# EAGLE design line_follower (EAGLE 9.5.0)

## Sheet 1 of 2
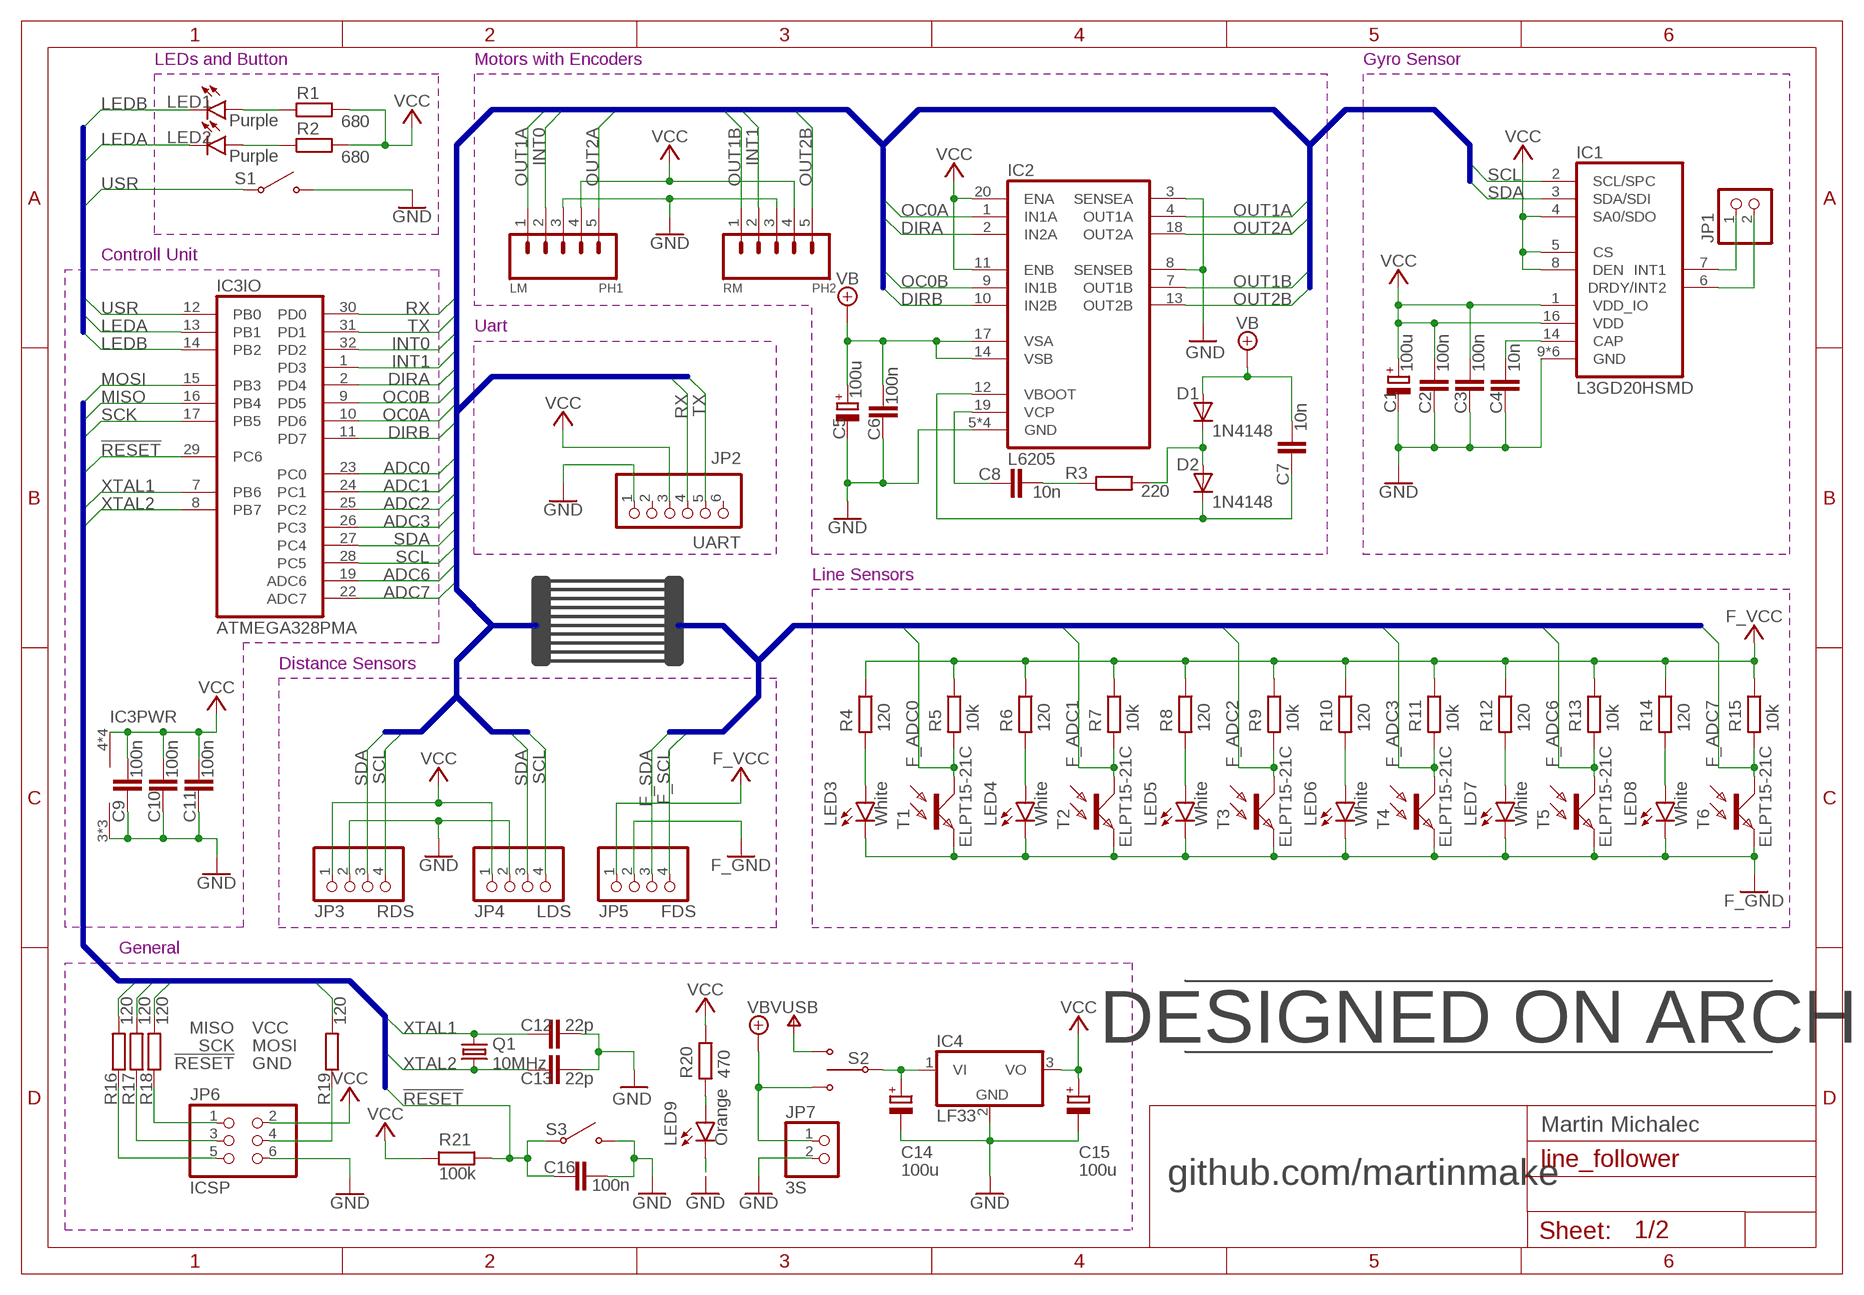
[diagram p0: schematic, sheet 1]

### Parts
C1  100u  CPOL-EUUD-6,3X8,8  [UD-6,3X5,8_NICHICON]
C2  100n  C-EUC1206  [C1206]
C3  100n  C-EUC1206  [C1206]
C4  10n  C-EUC1206  [C1206]
C5  100u  CPOL-EUUD-6,3X8,8  [UD-6,3X5,8_NICHICON]
C6  100n  C-EUC1206  [C1206]
C7  10n  C-EUC1206  [C1206]
C8  10n  C-EUC1206  [C1206]
C9  100n  C-EUC1206  [C1206]
C10  100n  C-EUC1206  [C1206]
C11  100n  C-EUC1206  [C1206]
C12  22p  C-EUC1206  [C1206]
C13  22p  C-EUC1206  [C1206]
C14  100u  CPOL-EUUD-6,3X8,8  [UD-6,3X5,8_NICHICON]
C15  100u  CPOL-EUUD-6,3X8,8  [UD-6,3X5,8_NICHICON]
C16  100n  C-EUC1206  [C1206]
D1  1N4148  DIODE  [1206]
D2  1N4148  DIODE  [1206]
IC1  L3GD20HSMD  [LGA-16]
IC2  L6205  [SO20]
IC3  ATMEGA328PMA  [TQFP32]
IC4  LF33  LM340H-05  [TO220H]
JP1  PINHD-1X2  [1X02]
JP2  UART  PINHD-1X6  [1X06]
JP3  RDS  PINHD-1X4/90  [1X04/90]
JP4  LDS  PINHD-1X4/90  [1X04/90]
JP5  FDS  PINHD-1X4/90  [1X04/90]
JP6  ICSP  PINHD-2X3  [2X03]
JP7  3S  PINHD-1X2  [1X02]
LED1  Purple  LEDSML1206  [SML1206]
LED2  Purple  LEDSML1206  [SML1206]
LED3  White  LEDSML1206  [SML1206]
LED4  White  LEDSML1206  [SML1206]
LED5  White  LEDSML1206  [SML1206]
LED6  White  LEDSML1206  [SML1206]
LED7  White  LEDSML1206  [SML1206]
LED8  White  LEDSML1206  [SML1206]
LED9  Orange  LEDSML1206  [SML1206]
PH1  LM  CONN_05JST-VERT  [JST-5-PTH-VERT]
PH2  RM  CONN_05JST-VERT  [JST-5-PTH-VERT]
Q1  10MHz  CSM-7X-DU  [CSM-7X-DU]
R1  680  R-EU_R1206  [R1206]
R2  680  R-EU_R1206  [R1206]
R3  220  R-EU_R1206  [R1206]
R4  120  R-EU_R1206  [R1206]
R5  10k  R-EU_R1206  [R1206]
R6  120  R-EU_R1206  [R1206]
R7  10k  R-EU_R1206  [R1206]
R8  120  R-EU_R1206  [R1206]
R9  10k  R-EU_R1206  [R1206]
R10  120  R-EU_R1206  [R1206]
R11  10k  R-EU_R1206  [R1206]
R12  120  R-EU_R1206  [R1206]
R13  10k  R-EU_R1206  [R1206]
R14  120  R-EU_R1206  [R1206]
R15  10k  R-EU_R1206  [R1206]
R16  120  R-EU_R1206  [R1206]
R17  120  R-EU_R1206  [R1206]
R18  120  R-EU_R1206  [R1206]
R19  120  R-EU_R1206  [R1206]
R20  470  R-EU_R1206  [R1206]
R21  100k  R-EU_R1206  [R1206]
S1  BUTTON  [BUTTON]
S2  DUALSWITCH  [DUALSWITCH]
S3  BUTTON  [BUTTON]
T1  ELPT15-21C  [1206]
T2  ELPT15-21C  [1206]
T3  ELPT15-21C  [1206]
T4  ELPT15-21C  [1206]
T5  ELPT15-21C  [1206]
T6  ELPT15-21C  [1206]

### Nets
!RESET: C16.1 IC3.29(IO:PC6) R16.2 R21.2 S3.A@1 S3.A@2
ADC0: IC3.23(IO:PC0) ; also sheet 2
ADC1: IC3.24(IO:PC1) ; also sheet 2
ADC2: IC3.25(IO:PC2) ; also sheet 2
ADC3: IC3.26(IO:PC3) ; also sheet 2
ADC6: IC3.19(IO:ADC6) ; also sheet 2
ADC7: IC3.22(IO:ADC7) ; also sheet 2
DIRA: IC2.2(IN2A) IC3.2(IO:PD4)
DIRB: IC2.10(IN2B) IC3.11(IO:PD7)
F_ADC0: R5.2 T1.1(C) ; also sheet 2
F_ADC1: R7.2 T2.1(C) ; also sheet 2
F_ADC2: R9.2 T3.1(C) ; also sheet 2
F_ADC3: R11.2 T4.1(C) ; also sheet 2
F_ADC6: R13.2 T5.1(C) ; also sheet 2
F_ADC7: R15.2 T6.1(C) ; also sheet 2
F_GND: JP5.2 LED3.C LED4.C LED5.C LED6.C LED7.C LED8.C T1.2(E) T2.2(E) T3.2(E) T4.2(E) T5.2(E) T6.2(E) ; also sheet 2
F_SCL: JP5.4 ; also sheet 2
F_SDA: JP5.3 ; also sheet 2
F_VCC: JP5.1 R4.1 R5.1 R6.1 R7.1 R8.1 R9.1 R10.1 R11.1 R12.1 R13.1 R14.1 R15.1 ; also sheet 2
GND: C1.- C2.2 C3.2 C4.2 C5.- C6.2 C9.2 C10.2 C11.2 C12.1 C13.1 C14.- C15.- C16.2 IC1.9(GND) IC1.10(GND) IC1.11(GND) IC1.12(GND) IC1.13(GND) IC1.15(GND) IC2.3(SENSEA) IC2.5(GND) IC2.6(GND) IC2.8(SENSEB) IC2.15(GND) IC2.16(GND) IC3.3(PWR:GND) IC3.5(PWR:GND) IC3.21(PWR:GND) IC4.2(GND) JP2.1 JP3.2 JP4.2 JP6.6 JP7.2 LED9.C PH1.3 PH2.3 S1.B@1 S1.B@2 S3.B@1 S3.B@2 ; also sheet 2
INT0: IC3.32(IO:PD2) PH1.2
INT1: IC3.1(IO:PD3) PH2.2
LEDA: IC3.13(IO:PB1) LED2.C
LEDB: IC3.14(IO:PB2) LED1.C
MISO: IC3.16(IO:PB4) R18.2
MOSI: IC3.15(IO:PB3) R19.2
N$1: LED5.A R8.2
N$2: C7.1 D2.2(C) IC2.12(VBOOT)
N$3: D1.2(C) D2.1(A) R3.2
N$4: C8.2 R3.1
N$5: LED1.A R1.1
N$6: C4.1 IC1.14(CAP)
N$7: C8.1 IC2.19(VCP)
N$8: IC1.7(INT1) JP1.1
N$9: IC1.6(DRDY/INT2) JP1.2
N$10: C14.+ IC4.1(VI) S2.COM
N$12: LED6.A R10.2
N$13: LED2.A R2.1
N$22: LED8.A R14.2
N$30: LED7.A R12.2
N$33: JP6.1 R18.1
N$36: LED9.A R20.2
N$43: LED4.A R6.2
N$47: LED3.A R4.2
N$49: JP6.3 R17.1
N$50: JP6.5 R16.1
N$51: JP6.4 R19.1
OC0A: IC2.1(IN1A) IC3.10(IO:PD6)
OC0B: IC2.9(IN1B) IC3.9(IO:PD5)
OUT1A: IC2.4(OUT1A) PH1.1
OUT1B: IC2.7(OUT1B) PH2.1
OUT2A: IC2.18(OUT2A) PH1.5
OUT2B: IC2.13(OUT2B) PH2.5
RX: IC3.30(IO:PD0) JP2.4
SCK: IC3.17(IO:PB5) R17.2
SCL: IC1.2(SCL/SPC) IC3.28(IO:PC5) JP3.4 JP4.4 ; also sheet 2
SDA: IC1.3(SDA/SDI) IC3.27(IO:PC4) JP3.3 JP4.3 ; also sheet 2
TX: IC3.31(IO:PD1) JP2.5
USR: IC3.12(IO:PB0) S1.A@1 S1.A@2
VB: C5.+ C6.1 C7.2 D1.1(A) IC2.14(VSB) IC2.17(VSA) JP7.1 S2.A
VCC: C1.+ C2.1 C3.1 C9.1 C10.1 C11.1 C15.+ IC1.1(VDD_IO) IC1.4(SA0/SDO) IC1.5(CS) IC1.8(DEN) IC1.16(VDD) IC2.11(ENB) IC2.20(ENA) IC3.4(PWR:VCC) IC3.6(PWR:VCC) IC3.18(PWR:VCC) IC3.20(PWR:VCC) IC4.3(VO) JP2.3 JP3.1 JP4.1 JP6.2 PH1.4 PH2.4 R1.2 R2.2 R20.1 R21.1 ; also sheet 2
VUSB: S2.B ; also sheet 2
XTAL1: C12.2 IC3.7(IO:PB6) Q1.2
XTAL2: C13.2 IC3.8(IO:PB7) Q1.1
Unconnected: JP2.2 JP2.6

### Buses
MISO,MOSI,MOSIR,!RESET,SCK,XTAL1,XTAL2
LEDA,LEDB,USR
FRONT:F_ADC0,F_ADC1,F_ADC2,F_ADC3,F_ADC6,F_ADC7,F_SCL,F_SDA
ADC0,ADC1,ADC2,ADC3,ADC6,ADC7,DIRA,DIRB,INT0,INT1,OC0A,OC0B,OUT1A,OUT1B,OUT2A,OUT2B,RX,SCL,SDA,TX

### Notes on the sheet
- LEDs and Button | Motors with Encoders | Gyro Sensor
- Controll Unit
- Uart
- Line Sensors
- Distance Sensors
- General
- DESIGNED ON ARCH
- Martin Michalec
- github.com/martinmake

## Sheet 2 of 2
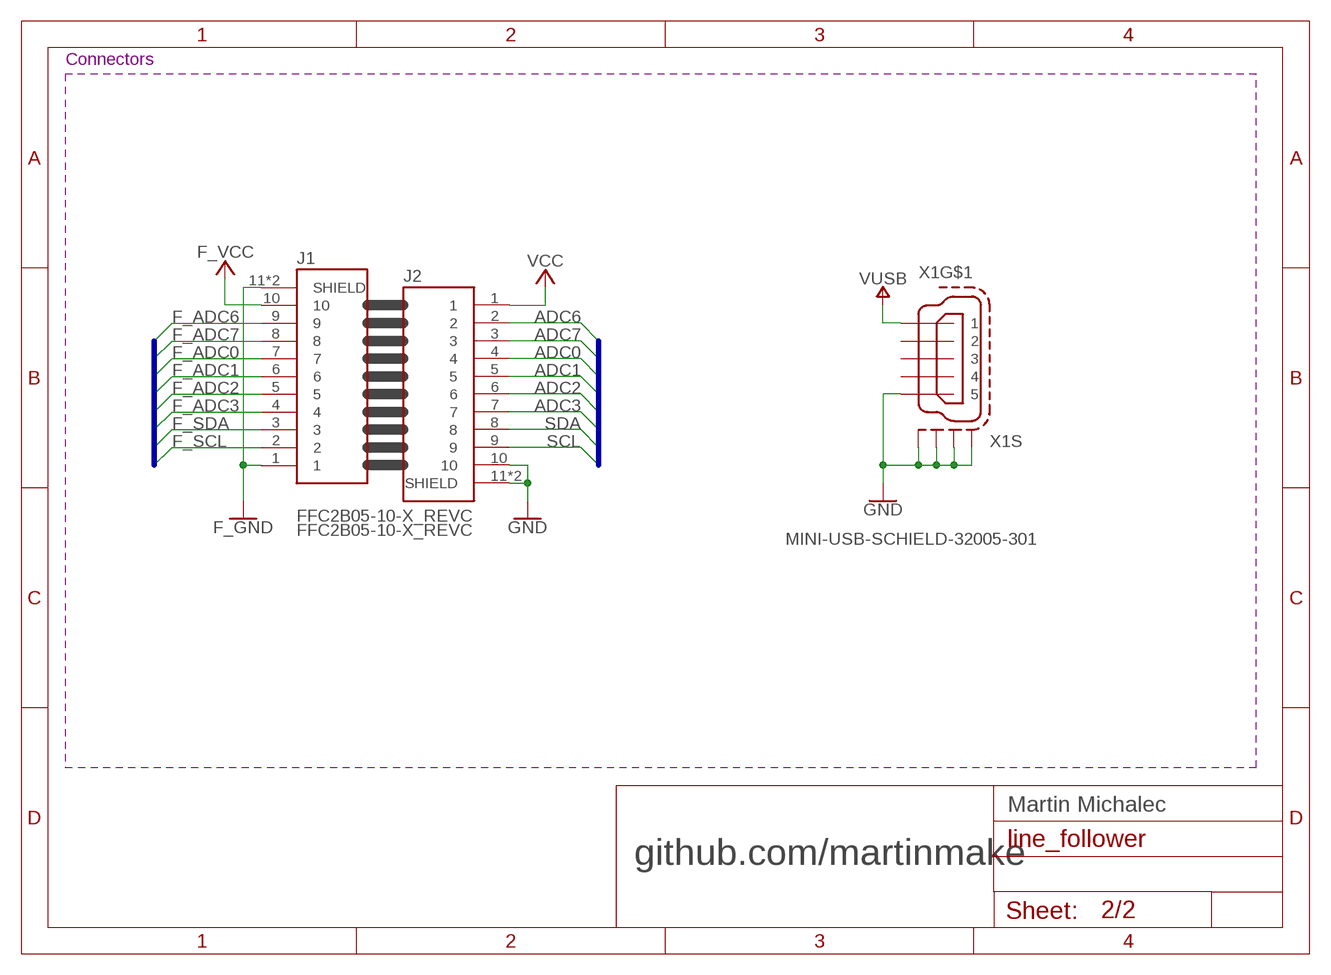
[diagram p1: schematic, sheet 2]

### Parts
J1  FFC2B05-10-X_REVC  [GCT_FFC2B05-10-X_REVC]
J2  FFC2B05-10-X_REVC  [GCT_FFC2B05-10-X_REVC]
X1  MINI-USB-SCHIELD-32005-301  [32005-301]

### Nets
ADC0: J2.4 ; also sheet 1
ADC1: J2.5 ; also sheet 1
ADC2: J2.6 ; also sheet 1
ADC3: J2.7 ; also sheet 1
ADC6: J2.2 ; also sheet 1
ADC7: J2.3 ; also sheet 1
F_ADC0: J1.7 ; also sheet 1
F_ADC1: J1.6 ; also sheet 1
F_ADC2: J1.5 ; also sheet 1
F_ADC3: J1.4 ; also sheet 1
F_ADC6: J1.9 ; also sheet 1
F_ADC7: J1.8 ; also sheet 1
F_GND: J1.1 J1.11(SHIELD) J1.12(SHIELD) ; also sheet 1
F_SCL: J1.2 ; also sheet 1
F_SDA: J1.3 ; also sheet 1
F_VCC: J1.10 ; also sheet 1
GND: J2.10 J2.11(SHIELD) J2.12(SHIELD) X1.5 X1.M1(S:S1) X1.M2(S:S2) X1.M3(S:S3) X1.M4(S:S4) ; also sheet 1
SCL: J2.9 ; also sheet 1
SDA: J2.8 ; also sheet 1
VCC: J2.1 ; also sheet 1
VUSB: X1.1 ; also sheet 1
Unconnected: X1.2 X1.3 X1.4

### Buses
FRONT:F_ADC0,F_ADC1,F_ADC2,F_ADC3,F_ADC6,F_ADC7,F_SCL,F_SDA
ADC0,ADC1,ADC2,ADC3,ADC6,ADC7,DIRA,DIRB,INT0,INT1,OC0A,OC0B,OUT1A,OUT1B,OUT2A,OUT2B,RX,SCL,SDA,TX

### Notes on the sheet
- Connectors
- Martin Michalec
- github.com/martinmake

## Library data of the parts
C1 C5 C14 C15 = rcl:CPOL-EU: POLARIZED CAPACITOR, European symbol; SPICEPREFIX: C
C2-C4 C6-C13 C16 = rcl:C-EU: CAPACITOR, European symbol; SPICEPREFIX: C
D1 D2 = martinmake:DIODE
IC1 = martinmake:L3GD20H
IC2 = martinmake:L6205
IC3 = martinmake:ATMEGA328P: 32A, 32-lead, 7 x 7 mm Body Size, 1.0 mm Body Thickness, 0.8 mm Lead Pitch, Thin Profile Plastic Quad Flat Package (TQFP)
IC4 = linear:LM340?-*: Positive VOLTAGE REGULATOR Source: http://cache.national.com/ds/LM/LM340.pdf
J1 J2 = FFC2B05-10-X_REVC:FFC2B05-10-X_REVC: FPC 0.5mm Pitch Side Entry, Top Contact, SMT,Height=1.2mm, ZIF, Slide Type; AVAILABILITY: Unavailable; DESCRIPTION: FFC/FPC CONNECTOR, RECEPTACLE, 10POS, 1ROW; Series: FFC2B05; Gender: Receptacle; Pitch Spacing: 0.5mm; No. of Contact...; MF: Global Connector Technology; MP: FFC2B05-10-T; PACKAGE: None; PRICE: None
JP1 JP7 = pinhead:PINHD-1X2: PIN HEADER
JP2 = pinhead:PINHD-1X6: PIN HEADER
JP3-JP5 = pinhead:PINHD-1X4: PIN HEADER
JP6 = pinhead:PINHD-2X3: PIN HEADER
LED1-LED9 = led:LED: LED OSRAM: - CHIPLED LG R971, LG N971, LY N971, LG Q971, LY Q971, LO R971, LY R971 LH N974, LH R974 LS Q976, LO Q976, LY Q976 LO Q996 - Hyper CHIPLED LW Q18S LB Q993, LB Q99A, LB R99A - SideLED LS A670, LO A670, LY A670, LG A670, LP A670 LB A673, LV A673, LT A673, LW A673 LH A674 LY A675 LS A676, LA A676, LO A676, LY A676, LW A676 LS A679, LY A679, LG A679 - Hyper Micro SIDELED® LS Y876, LA Y876, LO Y876, LY Y876 LT Y87S - SmartLED LW L88C, LW L88S LB L89C, LB L89S, LG L890 LS L89K, LO L89K, LY L89K LS L896, LA L896, LO L896, LY L896 - TOPLED LS T670, LO T670, LY T670, LG T670, LP T670 LSG T670, LSP T670, LSY T670, LOP T670, LYG T670 LG T671, LOG T671, LSG T671 LB T673, LV T673, LT T673, LW T673 LH T674 LS T676, LA T676, LO T676, LY T676, LB T676, LH T676, LSB T676, LW T676 LB T67C, LV T67C, LT T67C, LS T67K, LO T67K, LY T67K, LW E67C LS E67B, LA E67B, LO E67B, LY E67B, LB E67C, LV E67C, LT E67C LW T67C LS T679, LY T679, LG T679 LS T770, LO T770, LY T770, LG T770, LP T770 LB T773, LV T773, LT T773, LW T773 LH T774 LS E675, LA E675, LY E675, LS T675 LS T776, LA T776, LO T776, LY T776, LB T776 LHGB T686 LT T68C, LB T68C - Hyper Mini TOPLED® LB M676 - Mini TOPLED Santana® LG M470 LS M47K, LO M47K, LY M47K Source: http://www.osram.convergy.de LUXEON: - LUMILED® LXK2-PW12-R00, LXK2-PW12-S00, LXK2-PW14-U00, LXK2-PW14-V00 LXK2-PM12-R00, LXK2-PM12-S00, LXK2-PM14-U00 LXK2-PE12-Q00, LXK2-PE12-R00, LXK2-PE12-S00, LXK2-PE14-T00, LXK2-PE14-U00 LXK2-PB12-K00, LXK2-PB12-L00, LXK2-PB12-M00, LXK2-PB14-N00, LXK2-PB14-P00, LXK2-PB14-Q00 LXK2-PR12-L00, LXK2-PR12-M00, LXK2-PR14-Q00, LXK2-PR14-R00 LXK2-PD12-Q00, LXK2-PD12-R00, LXK2-PD12-S00 LXK2-PH12-R00, LXK2-PH12-S00 LXK2-PL12-P00, LXK2-PL12-Q00, LXK2-PL12-R00 Source: www.luxeon.com KINGBRIGHT: KA-3528ASYC Source: www.kingbright.com
PH1 PH2 = SparkFun-Connectors:CONN_05: Multi connection point. Often used as Generic Header-pin footprint for 0.1 inch spaced/style header connections On any of the 0.1 inch spaced packages, you can populate with these: Break Away Headers - Straight <https://www.sparkfun.com/products/116> (PRT-00116) Break Away Male Headers - Right Angle <https://www.sparkfun.com/products/553> (PRT-00553) Female Headers <https://www.sparkfun.com/products/115> (PRT-00115) Break Away Headers - Machine Pin <https://www.sparkfun.com/products/117> (PRT-00117) Break Away Female Headers - Swiss Machine Pin <https://www.sparkfun.com/products/743> (PRT-00743) For SCREWTERMINALS and SPRING TERMINALS visit here: Screw Terimnals on SparkFun.com <https://www.sparkfun.com/search/results?term=Screw+Terminals> (5mm/3.5mm/2.54mm spacing) This device is also useful as a general connection point to wire up your design to another part of your project. Our various solder wires solder well into these plated through hole pads. Hook-Up Wire - Assortment (Stranded, 22 AWG) <https://www.sparkfun.com/products/11375> (PRT-11375) Hook-Up Wire - Assortment (Solid Core, 22 AWG) <https://www.sparkfun.com/products/11367> (PRT-11367) View the entire wire category on our website here <https://www.sparkfun.com/categories/141> Special notes: Molex polarized connector foot print use with SKU : PRT-08231 with associated crimp pins and housings. 1MM SMD Version SKU: PRT-10208
Q1 = crystal:CSM-7X-DU: SMD CRYSTAL Source: www.ecsxtal.com .. Crystal 3.6864MHz CSM_7X_DU.PDF; OC_FARNELL: unknown; OC_NEWARK: unknown
R1-R21 = rcl:R-EU_: RESISTOR, European symbol; SPICEPREFIX: R
S1 S3 = martinmake:BUTTON
S2 = martinmake:DUALSWITCH
T1-T6 = martinmake:ELPT15-21C
X1 = con-cypressindustries:MINI-USB-SCHIELD-: MINI USB-B Conector Source: www.cypressindustries.com; OC_FARNELL: unknown; OC_NEWARK: unknown

## Board
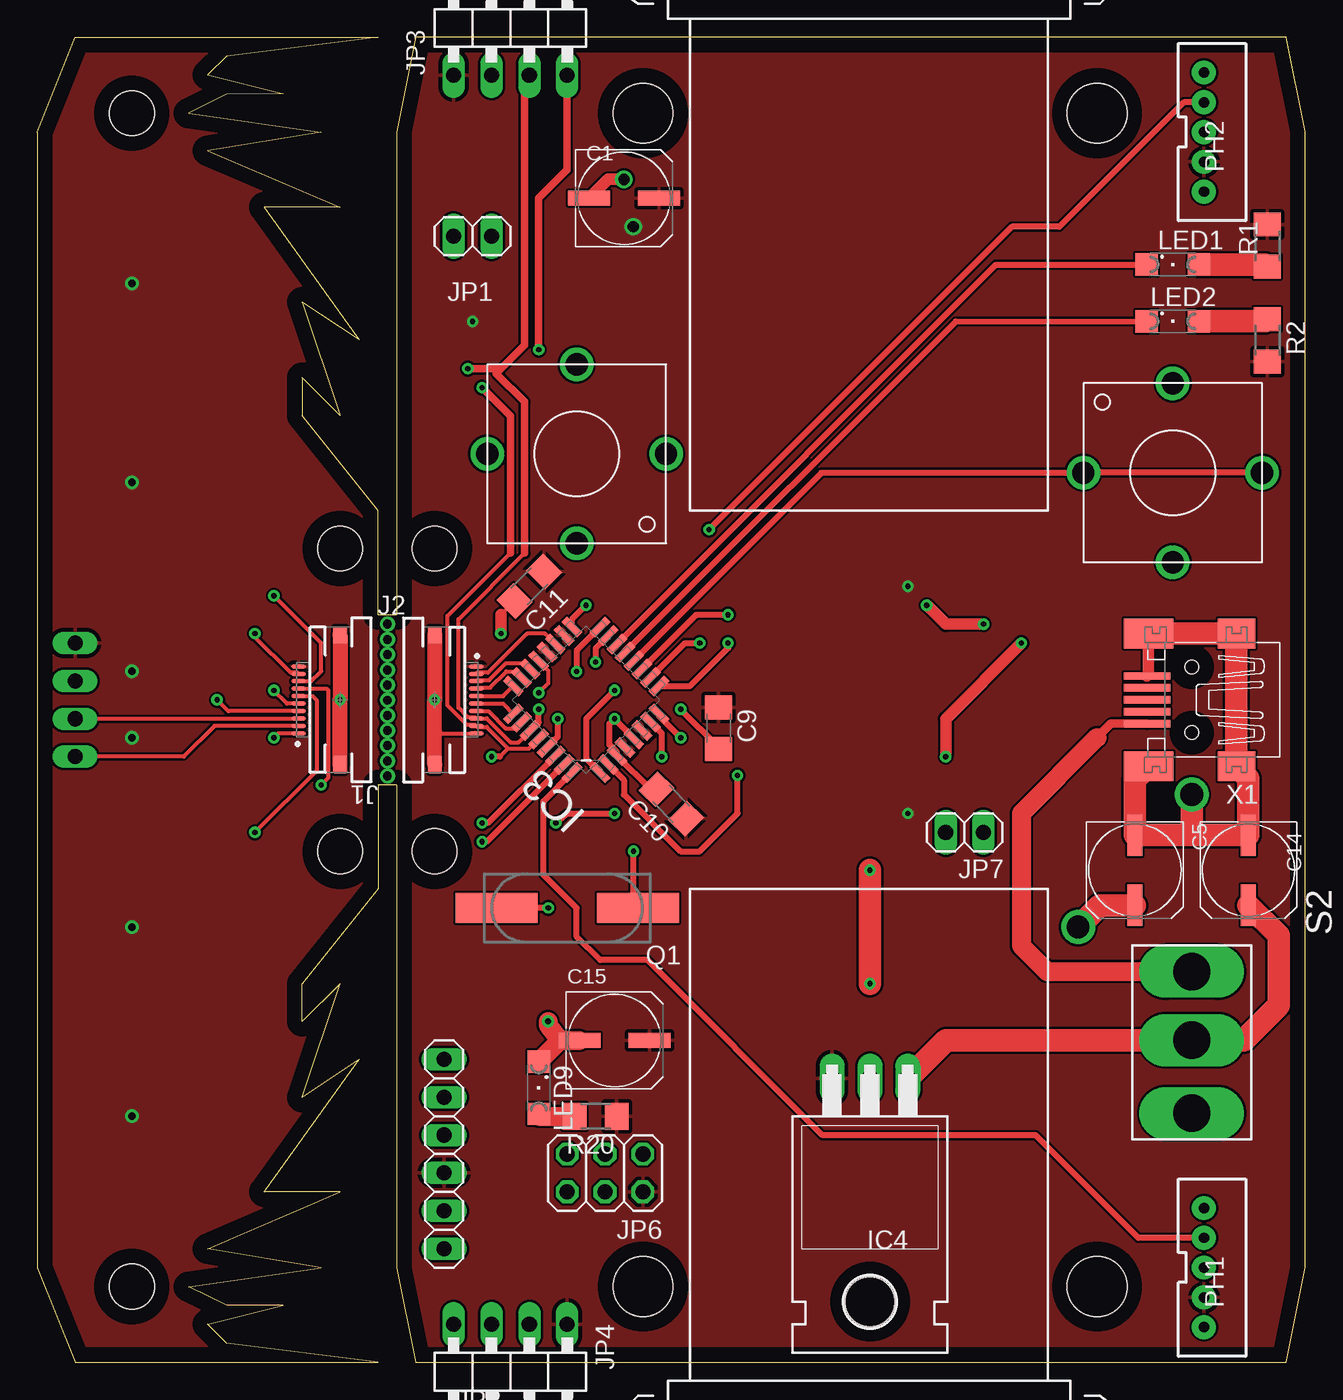
[diagram p2: board, top side]
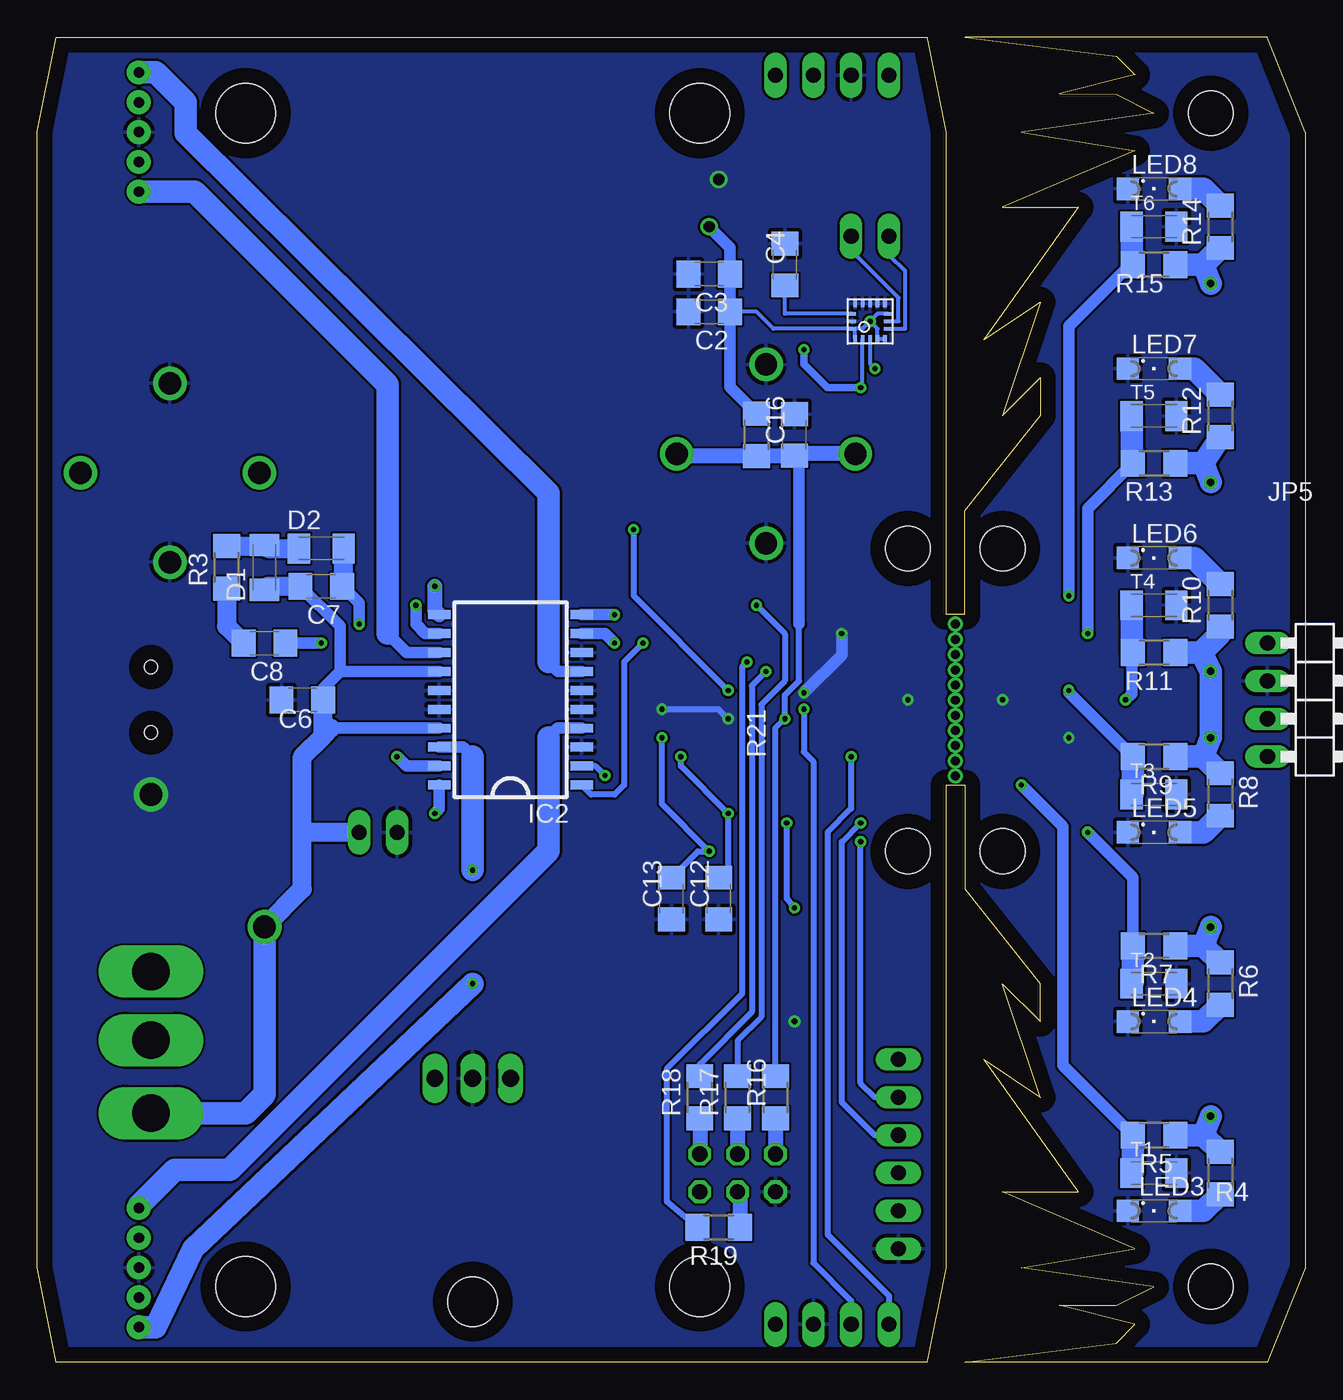
[diagram p3: board, bottom side, seen from below]

Size 85.1 x 88.91 mm. Coordinates in mm from the lower left corner, seen from the top.
Outline: 24.13,38.73 22.86,38.73 22.86,31.75 17.78,25.4 17.78,22.86 20.32,25.4 17.78,17.78 21.59,20.32 15.24,11.43 20.32,11.43 11.43,7.62 19.05,6.35 10.16,5.08 12.7,3.81 16.51,3.81 11.43,2.54 12.7,1.27 22.86,0 2.54,0 0,6.35 0,82.55 2.54,88.9 22.86,88.9 12.7,87.63 11.43,86.38 16.51,85.11 12.7,85.09 10.16,83.82 19.05,82.55 11.43,81.3 20.32,77.49 15.24,77.49 21.59,68.6 17.78,71.14 20.32,63.52 17.78,66.06 17.79,63.51 22.86,57.15 22.86,50.16 24.13,50.16 24.13,82.55 25.4,88.9 83.83,88.91 85.1,82.56 85.1,6.36 83.83,0 25.4,0 24.13,6.35 24.13,38.73
Copper layers (1*16): Top 0.035mm / dielectric 1.5mm / Bottom 0.035mm
Design rules "default": minimum track width 6mil, minimum drill 0.35mm, track to track 6mil, track to pad 6mil, pad to pad 6mil, via to via 6mil, smd to smd 6mil, copper to edge 40mil, drill to drill 6mil, minimum pad ring 10mil, minimum via ring 8mil, stop-mask expansion 4mil, vias tented up to drill 0mil, thermal gap 10mil
Holes 4 mm at 40.64,5.08 71.12,5.08 71.12,83.82 40.64,83.82
Holes 3 mm at 20.32,34.29 20.32,54.61 26.67,54.61 26.67,34.29 6.35,5.08 6.35,83.82

### Footprints (pad centres in the part's own frame; a part is rotated, then mirrored left to right if it is on the bottom)
UD-6,3X5,8_NICHICON = smd 2.8 x 1: + 2.35,0; - -2.35,0
C1206 = smd 1.6 x 1.8: 1 -1.4,0; 2 1.4,0
1206 = smd 1.5 x 2: 1 -1.5,0; 2 1.5,0
LGA-16 = smd 0.5 x 0.25: 1 -1.19,1; 2 -1.19,0.5; 3 -1.19,0; 4 -1.19,-0.5; 5 -1.19,-1; 9 1.19,-1; 10 1.19,-0.5; 11 1.19,0; 12 1.19,0.5; 13 1.19,1 | smd 0.25 x 0.5: 6 -0.5,-1.19; 7 0,-1.19; 8 0.5,-1.19; 14 0.5,1.19; 15 0,1.19; 16 -0.5,1.19
SO20 = smd 0.6 x 1.5: 1 -5.715,-4.78; 2 -4.445,-4.78; 3 -3.175,-4.78; 4 -1.905,-4.78; 5 -0.635,-4.78; 6 0.635,-4.78; 7 1.905,-4.78; 8 3.175,-4.78; 9 4.445,-4.78; 10 5.715,-4.78; 11 5.715,4.78; 12 4.445,4.78; 13 3.175,4.78; 14 1.905,4.78; 15 0.635,4.78; 16 -0.635,4.78; 17 -1.905,4.78; 18 -3.175,4.78; 19 -4.445,4.78; 20 -5.715,4.78
TQFP32 = smd 1.473 x 0.508: 1 -4.115,2.794; 2 -4.115,2.007; 3 -4.115,1.194; 4 -4.115,0.406; 5 -4.115,-0.406; 6 -4.115,-1.194; 7 -4.115,-2.007; 8 -4.115,-2.794; 17 4.115,-2.794; 18 4.115,-2.007; 19 4.115,-1.194; 20 4.115,-0.406; 21 4.115,0.406; 22 4.115,1.194; 23 4.115,2.007; 24 4.115,2.794 | smd 0.508 x 1.473: 9 -2.794,-4.115; 10 -2.007,-4.115; 11 -1.194,-4.115; 12 -0.406,-4.115; 13 0.406,-4.115; 14 1.194,-4.115; 15 2.007,-4.115; 16 2.794,-4.115; 25 2.794,4.115; 26 2.007,4.115; 27 1.194,4.115; 28 0.406,4.115; 29 -0.406,4.115; 30 -1.194,4.115; 31 -2.007,4.115; 32 -2.794,4.115
TO220H = drill 1.118 long: 1 -2.54,-10.16; 2 0,-10.16; 3 2.54,-10.16 | hole 3.302: 0,4.826
GCT_FFC2B05-10-X_REVC = smd 0.3 x 1: 1 -2.25,2.78; 2 -1.75,2.78; 3 -1.25,2.78; 4 -0.75,2.78; 5 -0.25,2.78; 6 0.25,2.78; 7 0.75,2.78; 8 1.25,2.78; 9 1.75,2.78; 10 2.25,2.78 | smd 1.2 x 0.95: 11 -4.35,0; 12 4.35,0
1X02 = drill 1.016 long: 1 -1.27,0; 2 1.27,0
1X06 = drill 1.016 long: 1 -6.35,0; 2 -3.81,0; 3 -1.27,0; 4 1.27,0; 5 3.81,0; 6 6.35,0
1X04/90 = drill 1.016 long: 1 -3.81,-3.81; 2 -1.27,-3.81; 3 1.27,-3.81; 4 3.81,-3.81
2X03 = drill 1.016 octagon: 1 -2.54,-1.27; 2 -2.54,1.27; 3 0,-1.27; 4 0,1.27; 5 2.54,-1.27; 6 2.54,1.27
SML1206 = smd 1.5 x 1.5: A 1.75,0; C -1.75,0
JST-5-PTH-VERT = drill 0.7 pad 1.6: 1 -4,0.18; 2 -2,0.18; 3 0,0.18; 4 2,0.18; 5 4,0.18
CSM-7X-DU = smd 5.5 x 2: 1 -4.75,0; 2 4.75,0
R1206 = smd 1.6 x 1.803: 1 -1.422,0; 2 1.422,0
BUTTON = drill 1.5: A@1 -6,0; A@2 6,0; B@1 0,6; B@2 0,-6
DUALSWITCH = drill 2.5 long: A 0,4.875; B 0,-4.625; COM 0,-0.025
32005-301 = smd 3.1 x 0.5: 1 3,1.6; 2 3,0.8; 3 3,0; 4 3,-0.8; 5 3,-1.6 | smd 2.5 x 2: M1 -3,-4.45; M2 -3,4.45 | smd 3.3 x 2: M3 2.9,4.45; M4 2.9,-4.45 | hole 0.9: 0,2.2; 0,-2.2

### Placement (x,y rotation side)
C1  39.37,78.1 0 top
C2  40.01,70.48 180 bottom
C3  40.01,73.02 180 bottom
C4  34.93,73.66 90 bottom
C5  73.66,33.02 270 top
C6  67.31,44.45 180 bottom
C7  66.04,52.07 180 bottom
C8  69.85,48.26 180 bottom
C9  45.72,42.54 270 top
C10  42.55,37.46 135 top
C11  33.02,52.07 225 top
C12  39.37,31.11 90 bottom
C13  42.55,31.11 90 bottom
C14  81.28,33.02 270 top
C15  38.74,21.59 0 top
C16  34.29,62.23 90 bottom
D1  69.85,53.34 90 bottom
D2  66.04,54.61 0 bottom
IC1  29.21,69.85 90 bottom
IC2  53.34,44.45 90 bottom
IC3  36.83,44.45 135 top
IC4  55.88,8.89 180 top
J1  20.32,44.45 90 top
J2  26.67,44.45 270 top
JP1  29.21,75.56 180 top
JP2  27.31,13.97 90 top
JP3  31.75,90.17 0 top
JP4  31.75,-1.27 180 top
JP5  -1.27,44.45 270 bottom
JP6  38.1,12.7 180 top
JP7  62.23,35.56 180 top
LED1  76.2,73.66 0 top
LED2  76.2,69.85 0 top
LED3  10.16,10.16 0 bottom
LED4  10.16,22.86 0 bottom
LED5  10.16,35.56 0 bottom
LED6  10.16,53.97 0 bottom
LED7  10.16,66.67 0 bottom
LED8  10.16,78.74 0 bottom
LED9  33.66,18.41 270 top
PH1  78.11,6.35 270 top
PH2  78.11,82.55 270 top
Q1  35.56,30.48 180 top
R1  82.55,74.93 90 top
R2  82.55,68.58 270 top
R3  72.39,53.34 90 bottom
R4  5.72,12.7 270 bottom
R5  10.16,15.24 180 bottom
R6  5.72,25.4 270 bottom
R7  10.16,27.94 180 bottom
R8  5.72,38.1 270 bottom
R9  10.16,40.64 180 bottom
R10  5.72,50.8 90 bottom
R11  10.16,47.62 180 bottom
R12  5.72,63.5 90 bottom
R13  10.16,60.32 180 bottom
R14  5.72,76.2 90 bottom
R15  10.16,73.66 180 bottom
R16  35.56,17.78 90 bottom
R17  38.1,17.78 90 bottom
R18  40.64,17.78 90 bottom
R19  39.37,9.05 180 bottom
R20  37.47,16.51 180 top
R21  36.83,62.23 270 bottom
S1  76.2,59.69 0 top
S2  77.47,21.59 180 top
S3  36.2,60.96 180 top
T1  10.16,12.7 0 bottom
T2  10.16,25.4 0 bottom
T3  10.16,38.1 0 bottom
T4  10.16,50.8 0 bottom
T5  10.16,63.5 0 bottom
T6  10.16,76.2 0 bottom
X1  77.47,44.45 180 top

### Tracks (layer width: path | path; a pad name or v marks a point on that pad's centre or on a via)
!RESET  (via drill 0.35)
  Top 0.406: v34.93,43.18 34.93,41.97 IC3.29
  Bottom 0.406: 35.56,19.77 R16.2 35.56,42.54 v34.93,43.18 34.93,44.77 33.97,45.72 33.97,49.53
  Bottom 0.762: 33.97,49.53 33.97,60.51 C16.1
  Bottom 1.016: S3.A@2 34.16,60.96 C16.1 36.81,60.83 R21.2 42.04,60.81 S3.A@1
ADC0
  Top 0.254: J2.4 29.52,45.27 30.39,45.27 31.49,46.36 32.08,46.36 IC3.23
ADC1
  Top 0.254: IC3.24 31.26,44.7 J2.5
ADC2
  Top 0.254: IC3.25 31.26,44.2 J2.6
ADC3
  Top 0.254: IC3.26 32.08,42.54 31.44,42.54 30.28,43.7 J2.7
ADC6
  Top 0.254: J2.2 29.52,46.27 30.25,46.27 32.87,48.89 34.07,48.89 IC3.19
ADC7
  Top 0.254: J2.3 29.52,45.77 30.32,45.77 31.47,46.92 32.67,46.92 IC3.22
DIRA  (via drill 0.35)
  Top 0.406: IC3.2 39.37,39.07 39.37,38.1 43.18,34.29 44.45,34.29 46.99,36.83 v46.99,39.37
  Bottom 0.406: v46.99,39.37 47.63,40 IC2.2
DIRB  (via drill 0.35)
  Top 0.406: IC3.11 44.23,50.16 v46.36,50.16
  Bottom 0.762: IC2.10 v46.36,50.16
F_ADC0  (via drill 0.35)
  Top 0.254: J1.7 19.42,45.2 19.53,45.08 19.53,39.22 v19.05,38.73
  Bottom 0.762: R5.2 16.26,19.92 16.26,35.95 v19.05,38.73
  Bottom 1.524: T1.1 11.58,12.78 R5.2
F_ADC1  (via drill 0.35)
  Top 0.254: J1.6 18.48,44.7 18.73,44.45 18.73,39.69 v14.61,35.56
  Bottom 0.762: v14.61,35.56 11.58,32.54 R7.2
  Bottom 1.524: T2.1 11.58,25.48 R7.2
F_ADC2  (via drill 0.35)
  Top 0.254: J1.5 16.76,44.2 v15.88,45.08
  Bottom 0.254: v15.88,45.08 15.88,44.93
  Bottom 0.762: 15.88,44.93 R9.2
  Bottom 1.524: T3.1 11.58,38.18 R9.2
F_ADC3  (via drill 0.35)
  Top 0.254: J1.4 12.82,43.7 v12.07,44.45
  Bottom 0.762: v12.07,44.45 11.66,44.85 11.66,47.7 | 11.66,47.7
  Bottom 1.524: T4.1 11.66,47.7 | 11.66,47.7 | 11.66,47.7 R11.2
F_ADC6  (via drill 0.35)
  Top 0.254: J1.9 17.47,46.27 17.01,46.27 14.61,48.68 v14.61,48.89
  Bottom 0.762: v14.61,48.89 14.61,57.3 R13.2
  Bottom 1.524: T5.1 11.66,60.4 R13.2
F_ADC7  (via drill 0.35)
  Top 0.254: J1.8 18.4,45.7 19.05,46.35 19.05,48.26 v15.88,51.43
  Bottom 0.762: v15.88,51.43 15.88,69.52 11.74,73.66 R15.2
  Bottom 1.524: T6.1 11.66,73.74 R15.2
F_GND  (via drill 0.35)
  Top 0.254: 20.03,42.2 20.32,41.91 | 20.32,41.91 | J1.1 16.17,42.2 v15.88,41.91
  Top 1.016: J1.11 20.32,41.91 v20.32,44.45 J1.12
  pour Bottom: 0,0 22.86,0 22.86,88.9 0,88.9
F_SCL
  Top 0.254: J1.2 11.9,42.7 9.84,40.64 JP5.4
F_SDA
  Top 0.254: J1.3 17.52,43.18 JP5.3
F_VCC  (via drill 0.5)
  Bottom 1.524: R6.1 6.83,27.94 | 6.83,27.94 | 6.83,27.94 | 6.83,27.94 R7.1 | R8.1 6.83,40.64 | 6.83,40.64 | 6.83,40.64 | 6.83,40.64 R9.1 | 6.83,73.66 R14.1 | R4.1 6.83,15.24 | 6.83,15.24 | 6.83,15.24 | 6.83,15.24 R5.1 | v6.35,72.39 6.83,73.66 | 6.83,73.66 | v6.35,29.21 6.83,27.94 | v6.35,16.51 6.83,15.24 | R15.1 6.83,73.66 | 6.83,73.66 | v6.35,59.05 6.83,60.32 | R12.1 6.83,60.32 | 6.83,60.32 | 6.83,60.32 R13.1 | R10.1 5.72,48.89 6.99,47.62 | 6.99,47.62 | 6.99,47.62 R11.1 | 6.83,40.64 v6.35,41.91 v6.35,46.35 6.99,47.62 | 6.99,47.62
  pour Top: 22.86,88.9 22.86,0 0,0 0,88.9
GND  (via drill 0.35, 0.4, 0.76, 1.52)
  Top 0.254: IC3.21 34.29,46.42 34.29,45.56 v33.66,44.93 | 31.12,50.16 C11.2 | 29.35,42.23 29.35,42.22 29.43,42.22 J2.10 26.7,42.2 26.67,42.23
  Top 0.406: IC3.5 40.03,41.89 v38.74,43.18 38.4,42.84 38.4,41.45 38.9,40.95 IC3.3 41.14,38.45 C10.2 | v43.18,43.81 45.72,41.27 C9.2
  Top 0.762: X1.M4 74.57,46.15 X1.5 | v31.12,48.89 31.12,50.16 | C1.- 38.29,79.37 v39.37,79.37
  Top 1.016: J2.12 26.67,42.23 v26.67,44.45 J2.11
  Top 1.27: LED9.C 35.08,21.59 | 35.08,21.59 | 35.08,21.59 C15.- | v34.29,22.86 34.29,22.63 35.08,21.59
  Top 1.524: 77.47,35.37 C5.- 73.66,39.09 X1.M3 | 77.47,35.37 C14.- 81.28,39.19 X1.M2 X1.M1 X1.M4 | 77.47,35.37 | v77.47,38.1 77.47,35.37 | 77.47,35.37
  Bottom 0.406: v38.74,43.18 39.37,43.81 v43.18,43.81
  Bottom 0.762: v33.66,44.93 31.12,47.47 v31.12,48.89
  pour Bottom: 24.13,0 85.09,0 85.09,88.9 24.13,88.9
INT0
  Top 0.406: IC3.32 33.97,37.64 33.97,32.7 36.2,30.48 36.2,28.57 37.78,26.99 40.96,26.99 52.71,15.24 67,15.24 73.89,8.35 PH1.2
INT1  (via drill 0.35)
  Top 0.406: v45.09,55.88 65.41,76.2 68.58,76.2 76.93,84.55 PH2.2 | IC3.1 36.83,40.5 36.83,43.18 v38.74,45.08
  Bottom 0.406: v45.09,55.88 45.09,51.43 v38.74,45.08
LEDA
  Top 0.406: IC3.13 | IC3.13 61.64,69.83 LED2.C
LEDB
  Top 0.406: LED1.C 64.34,73.65 IC3.14
MISO  (via drill 0.35)
  Top 0.406: IC3.16 36.2,47.77 v36.2,46.35
  Bottom 0.406: v36.2,46.35 37.15,45.4 37.15,23.49 40.64,20 R18.2 40.96,19.52
MOSI  (via drill 0.35)
  Top 0.406: IC3.15 37.47,47.92 v37.47,46.99
  Bottom 0.406: R19.2 42.86,10.8 42.86,19.68 37.78,24.76 37.78,46.67 v37.47,46.99
N$1
  Bottom 1.524: LED5.A 6.83,35.56 R8.2
N$2  (via drill 0.35)
  Top 0.762: v63.5,49.53 60.96,49.53 v59.69,50.8
  Bottom 0.762: C7.1 63.5,50.93 v63.5,49.53 | v59.69,50.8 59.69,49.53 59.06,48.89 IC2.12
  Bottom 1.27: C7.1 64.54,52.17 D2.2
N$3
  Bottom 1.27: R3.2 69.93,54.76 D1.2 69.62,54.61 D2.1
N$4
  Bottom 1.27: R3.1 72.39,49.4 C8.2
N$5
  Top 1.524: LED1.A 82.4,73.66 R1.1
N$6
  Bottom 0.254: IC1.14 34.93,70.35 C4.1
N$7  (via drill 0.35)
  Top 0.762: v66.04,48.26 60.96,43.18 v60.96,40.64
  Bottom 0.762: C8.1 v66.04,48.26 | v60.96,40.64 60.33,40 IC2.19
N$8
  Bottom 0.254: IC1.7 27.31,69.85 27.31,71.44 30.48,74.61 JP1.1
N$9
  Bottom 0.254: IC1.6 26.85,69.35 26.85,73.21 27.94,74.29 JP1.2
N$10
  Top 1.524: IC4.1 60.99,21.61 S2.COM 80.97,21.61 83.31,23.96 83.31,28.64 C14.+
N$11  (via drill 0.6)
  other vias: 23.5,49.53
N$12
  Bottom 1.524: R10.2 7.47,53.97 LED6.A
N$13
  Top 1.27: 82.4,69.85 R2.1
  Top 1.524: LED2.A 82.4,69.85
N$14  (via drill 0.6)
  other vias: 23.5,48.5
N$15  (via drill 0.6)
  other vias: 23.5,47.49
N$16  (via drill 0.6)
  other vias: 23.5,46.46
N$17  (via drill 0.6)
  other vias: 23.5,45.44
N$18  (via drill 0.6)
  other vias: 23.5,44.42
N$19  (via drill 0.6)
  other vias: 23.5,43.41
N$20  (via drill 0.6)
  other vias: 23.5,42.39
N$21  (via drill 0.6)
  other vias: 23.5,41.38
N$22
  Bottom 1.524: R14.2 6.83,78.74 LED8.A
N$23  (via drill 0.6)
  other vias: 23.5,40.36
N$24  (via drill 0.6)
  other vias: 23.5,39.34
N$30
  Bottom 1.524: R12.2 7.47,66.67 LED7.A
N$33
  Bottom 1.016: R18.1 JP6.1
N$36
  Top 1.27: LED9.A 33.66,16.51 R20.2
N$43
  Bottom 1.524: LED4.A 6.83,22.86 R6.2
N$47
  Bottom 1.524: LED3.A 6.83,10.16 R4.2
N$49
  Bottom 1.016: R17.1 JP6.3
N$50
  Bottom 1.016: R16.1 JP6.5
N$51
  Bottom 1.016: JP6.4 37.95,11.28 R19.1
OC0A  (via drill 0.35)
  Top 0.406: IC3.10 43.48,48.26 v44.45,48.26
  Bottom 0.406: v44.45,48.26 45.72,46.99 45.72,38.73 46.36,38.1 47.93,38.1 IC2.1
OC0B  (via drill 0.35)
  Top 0.406: IC3.9 43.82,45.38 46.36,47.92 v46.36,48.26
  Bottom 0.762: v46.36,48.26 46.99,48.89 IC2.9
OUT1A
  Bottom 0.762: IC2.4 50.18,42.54 50.8,41.92
  Bottom 1.524: 50.8,41.92 50.8,34.3 72.2,12.9 75.89,12.9 78.29,10.51 PH1.1
OUT1B
  Bottom 0.762: IC2.7 50.15,46.35 50.8,47
  Bottom 1.524: 50.8,47 50.8,58.34 75.13,82.47 75.13,84.54 77.13,86.55 PH2.1
OUT2A  (via drill 0.35)
  Top 1.524: v55.88,33.02 v55.88,25.4
  Bottom 0.762: IC2.18 56.52,41.27 55.88,40.64
  Bottom 1.524: 55.88,40.64 v55.88,33.02 | PH1.5 77.17,2.35 74.63,7.61 v55.88,25.4
OUT2B
  Bottom 0.762: IC2.13 60.33,47.62 61.6,48.89
  Bottom 1.524: 61.6,48.89 61.6,65.6 74.54,78.55 PH2.5
RX  (via drill 0.35)
  Top 0.406: v29.85,36.19 30.26,36.19 IC3.30
  Bottom 0.406: v29.85,36.19 31.12,34.92 31.12,17.45 28.9,15.24 JP2.4
SCK  (via drill 0.35)
  Top 0.406: IC3.17 35.9,49.87 v36.83,50.8
  Bottom 0.406: v36.83,50.8 34.93,48.89 34.93,45.72 36.51,44.13 36.51,23.18 38.1,21.59 R17.2 38.1,19.68
SCL  (via drill 0.35)
  Top 0.254: 31.6,41.19 30.16,42.63 29.52,42.63 J2.9 29.38,42.77 28.85,42.77 27.53,44.08 27.53,50.08 31.75,54.29 | IC3.28 32.99,41.19 31.6,41.19 | 31.6,41.19 31.06,40.64
  Top 0.406: 31.06,40.64 v30.48,40.64
  Top 0.508: 31.75,54.29 31.75,63.5 v29.85,65.4 | v33.66,67.94 33.66,78.1 35.56,80.01 JP3.4
  Bottom 0.254: v29.85,65.4 29.71,65.54 IC1.2
  Bottom 0.406: JP4.4 27.94,4.44 32.07,8.57 32.07,35.56 30.48,37.15 v30.48,40.64
  Bottom 0.508: v29.85,65.4 32.07,65.4 33.66,66.99 v33.66,67.94
SDA  (via drill 0.35)
  Top 0.254: IC3.27 32.28,41.59 31.77,41.59 30.16,43.2 J2.8 29.38,43.27 28.92,43.27 28.26,43.93 28.26,49.85 32.7,54.29
  Top 0.406: IC3.27 33.66,42.96 v33.66,43.81
  Top 0.508: 32.7,54.29 32.7,64.45 30.8,66.36 31.12,66.67 | v28.89,66.67 31.12,66.67 | 31.12,66.67 32.7,68.26 32.7,86.04 JP3.3
  Bottom 0.254: IC1.3 29.21,66.99 v28.89,66.67
  Bottom 0.406: v33.66,43.81 33.66,40.96 33.02,40.32 33.02,6.67 30.48,4.13 JP4.3
TX  (via drill 0.35)
  Top 0.406: v29.85,34.92 30.14,34.92 IC3.31
  Bottom 0.406: JP2.5 28.9,17.78 29.85,18.72 v29.85,34.92
USR
  Top 0.406: S1.A@2 S1.A@1 52.61,59.69 52.61,59.65 IC3.12
VB  (via drill 1.52)
  Top 1.524: v69.85,29.21 71.31,30.67 C5.+
  Bottom 0.559: 65.91,45.21 C6.1
  Bottom 0.762: 65.41,42.54 IC2.17 | 64.77,46.35 IC2.14 | 64.77,46.35 | 64.77,46.35 65.91,45.21 | C7.2 64.77,49.4 64.77,46.35
  Bottom 1.27: v69.85,29.21 67.31,31.75 67.31,35.56 | 67.31,35.56 67.31,35.57 67.31,40.64 65.91,42.04 | 65.91,42.04 C6.1 | 65.91,42.04 | 65.41,42.54 65.91,42.04 | C7.2 69.62,52.07 D1.1 | JP7.1 67.31,35.56
  Bottom 1.524: S2.A 71.12,16.71 69.85,17.98 v69.85,29.21
VCC  (via drill 0.35, 0.76)
  Bottom 0.254: IC1.16 35.7,69.35 36.83,70.48 C2.1 | IC1.5 IC1.4 28.71,69.35 v29.21,69.85 | 30.21,69.35 29.71,69.35 v29.21,69.85 | 30.48,69.35 IC1.16 | IC1.8 28.71,70.35 v29.21,69.85 | IC1.1 30.21,69.35 | IC1.16 30.21,69.35 | 30.21,69.35
  Bottom 0.762: IC2.20 58.12,37.13 v58.42,36.83 | v40.01,76.2 38.61,74.8 C3.1 C2.1 38.61,65.43 R21.1
  Bottom 1.016: IC2.11 58.42,50.46 v58.42,52.07
  pour Top: 24.13,88.9 85.09,88.9 85.09,0 24.13,0
VUSB
  Top 0.559: X1.1 72.06,42.85 71.12,41.91
  Top 1.27: 71.12,41.91 66.04,36.83 66.04,27.94 67.77,26.21 S2.B
XTAL1  (via drill 0.35)
  Top 0.406: IC3.7 41.91,42.21 v41.91,40.64 | v34.8,36.19 35.56,36.83 v38.74,36.83 | v34.29,30.48 Q1.2
  Bottom 0.406: v41.91,40.64 41.91,40 v38.74,36.83 38.74,33.15 C12.2 | v34.29,30.48 34.8,31.11 v34.8,36.19
XTAL2  (via drill 0.35)
  Top 0.406: Q1.1 40.01,30.78 v40.01,34.29 | v43.18,41.91 41.72,43.37 IC3.8
  Bottom 0.406: C13.2 40.77,34.29 v40.01,34.29 43.18,37.46 v43.18,41.91